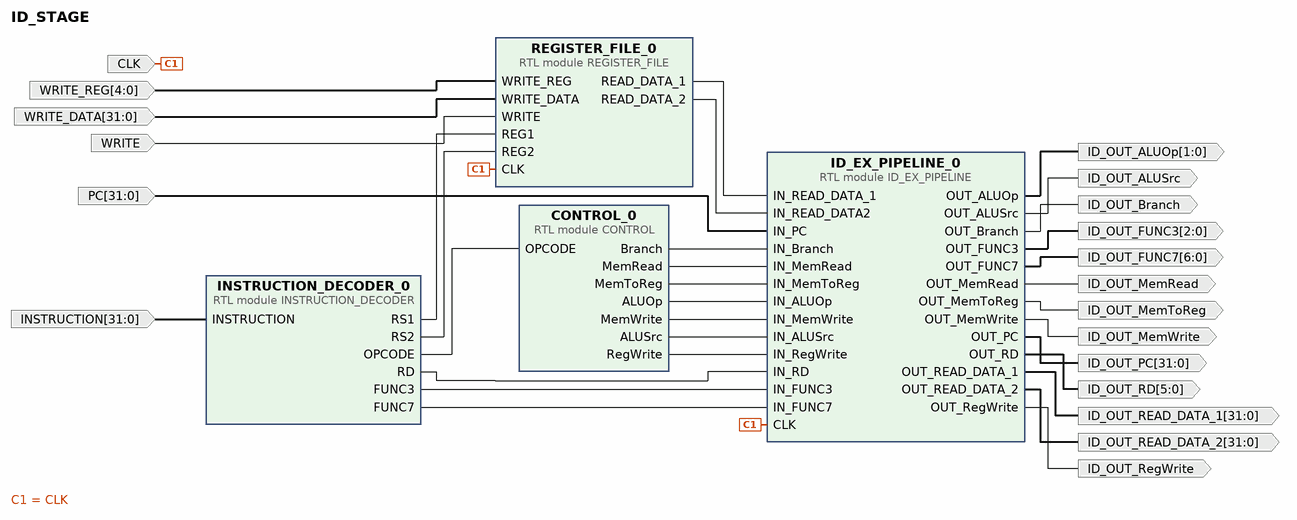
[diagram p0: block diagram of the top level]
# Vivado block design ID_STAGE, xc7z020clg400-1, Vivado 2020.2
create_bd_design ID_STAGE

create_bd_port -dir I -type clk CLK
create_bd_port -dir I -from 31 -to 0 INSTRUCTION
create_bd_port -dir I -from 31 -to 0 PC
create_bd_port -dir I -from 4 -to 0 WRITE_REG
create_bd_port -dir I -from 31 -to 0 WRITE_DATA
create_bd_port -dir I WRITE
create_bd_port -dir O ID_OUT_ALUSrc
create_bd_port -dir O -from 31 -to 0 ID_OUT_READ_DATA_1
create_bd_port -dir O -from 5 -to 0 ID_OUT_RD
create_bd_port -dir O -from 2 -to 0 ID_OUT_FUNC3
create_bd_port -dir O -from 6 -to 0 ID_OUT_FUNC7
create_bd_port -dir O -from 1 -to 0 ID_OUT_ALUOp
create_bd_port -dir O -from 31 -to 0 ID_OUT_PC
create_bd_port -dir O ID_OUT_MemToReg
create_bd_port -dir O ID_OUT_Branch
create_bd_port -dir O -from 31 -to 0 ID_OUT_READ_DATA_2
create_bd_port -dir O ID_OUT_MemRead
create_bd_port -dir O ID_OUT_MemWrite
create_bd_port -dir O ID_OUT_RegWrite

create_bd_cell -type module -reference INSTRUCTION_DECODER INSTRUCTION_DECODER_0
create_bd_cell -type module -reference CONTROL CONTROL_0
create_bd_cell -type module -reference REGISTER_FILE REGISTER_FILE_0
create_bd_cell -type module -reference ID_EX_PIPELINE ID_EX_PIPELINE_0

# ---- connections ----

connect_bd_net -net CLK_0_1 [get_bd_ports CLK] [get_bd_pins REGISTER_FILE_0/CLK] [get_bd_pins ID_EX_PIPELINE_0/CLK]
connect_bd_net [get_bd_pins REGISTER_FILE_0/READ_DATA_1] [get_bd_pins ID_EX_PIPELINE_0/IN_READ_DATA_1]
connect_bd_net [get_bd_pins REGISTER_FILE_0/READ_DATA_2] [get_bd_pins ID_EX_PIPELINE_0/IN_READ_DATA2]
connect_bd_net [get_bd_pins INSTRUCTION_DECODER_0/OPCODE] [get_bd_pins CONTROL_0/OPCODE]
connect_bd_net -net IN_PC_0_1 [get_bd_ports PC] [get_bd_pins ID_EX_PIPELINE_0/IN_PC]
connect_bd_net [get_bd_pins CONTROL_0/Branch] [get_bd_pins ID_EX_PIPELINE_0/IN_Branch]
connect_bd_net [get_bd_pins CONTROL_0/MemRead] [get_bd_pins ID_EX_PIPELINE_0/IN_MemRead]
connect_bd_net [get_bd_pins CONTROL_0/MemToReg] [get_bd_pins ID_EX_PIPELINE_0/IN_MemToReg]
connect_bd_net [get_bd_pins CONTROL_0/ALUOp] [get_bd_pins ID_EX_PIPELINE_0/IN_ALUOp]
connect_bd_net [get_bd_pins CONTROL_0/MemWrite] [get_bd_pins ID_EX_PIPELINE_0/IN_MemWrite]
connect_bd_net [get_bd_pins CONTROL_0/ALUSrc] [get_bd_pins ID_EX_PIPELINE_0/IN_ALUSrc]
connect_bd_net [get_bd_pins CONTROL_0/RegWrite] [get_bd_pins ID_EX_PIPELINE_0/IN_RegWrite]
connect_bd_net [get_bd_pins INSTRUCTION_DECODER_0/RD] [get_bd_pins ID_EX_PIPELINE_0/IN_RD]
connect_bd_net [get_bd_pins INSTRUCTION_DECODER_0/FUNC3] [get_bd_pins ID_EX_PIPELINE_0/IN_FUNC3]
connect_bd_net [get_bd_pins INSTRUCTION_DECODER_0/RS1] [get_bd_pins REGISTER_FILE_0/REG1]
connect_bd_net [get_bd_pins INSTRUCTION_DECODER_0/RS2] [get_bd_pins REGISTER_FILE_0/REG2]
connect_bd_net -net WRITE_REG_0_1 [get_bd_ports WRITE_REG] [get_bd_pins REGISTER_FILE_0/WRITE_REG]
connect_bd_net -net WRITE_DATA_0_1 [get_bd_ports WRITE_DATA] [get_bd_pins REGISTER_FILE_0/WRITE_DATA]
connect_bd_net -net WRITE_0_1 [get_bd_ports WRITE] [get_bd_pins REGISTER_FILE_0/WRITE]
connect_bd_net [get_bd_pins INSTRUCTION_DECODER_0/FUNC7] [get_bd_pins ID_EX_PIPELINE_0/IN_FUNC7]
connect_bd_net [get_bd_pins ID_EX_PIPELINE_0/OUT_ALUSrc] [get_bd_ports ID_OUT_ALUSrc]
connect_bd_net [get_bd_pins ID_EX_PIPELINE_0/OUT_READ_DATA_1] [get_bd_ports ID_OUT_READ_DATA_1]
connect_bd_net [get_bd_pins ID_EX_PIPELINE_0/OUT_RD] [get_bd_ports ID_OUT_RD]
connect_bd_net [get_bd_pins ID_EX_PIPELINE_0/OUT_FUNC3] [get_bd_ports ID_OUT_FUNC3]
connect_bd_net [get_bd_pins ID_EX_PIPELINE_0/OUT_FUNC7] [get_bd_ports ID_OUT_FUNC7]
connect_bd_net [get_bd_pins ID_EX_PIPELINE_0/OUT_ALUOp] [get_bd_ports ID_OUT_ALUOp]
connect_bd_net [get_bd_pins ID_EX_PIPELINE_0/OUT_PC] [get_bd_ports ID_OUT_PC]
connect_bd_net [get_bd_pins ID_EX_PIPELINE_0/OUT_MemToReg] [get_bd_ports ID_OUT_MemToReg]
connect_bd_net [get_bd_pins ID_EX_PIPELINE_0/OUT_Branch] [get_bd_ports ID_OUT_Branch]
connect_bd_net [get_bd_pins ID_EX_PIPELINE_0/OUT_READ_DATA_2] [get_bd_ports ID_OUT_READ_DATA_2]
connect_bd_net [get_bd_pins ID_EX_PIPELINE_0/OUT_MemRead] [get_bd_ports ID_OUT_MemRead]
connect_bd_net [get_bd_pins ID_EX_PIPELINE_0/OUT_MemWrite] [get_bd_ports ID_OUT_MemWrite]
connect_bd_net [get_bd_pins ID_EX_PIPELINE_0/OUT_RegWrite] [get_bd_ports ID_OUT_RegWrite]
connect_bd_net [get_bd_ports INSTRUCTION] [get_bd_pins INSTRUCTION_DECODER_0/INSTRUCTION]

validate_bd_design
save_bd_design
